# EAGLE design B130X (EAGLE 6.6.0)
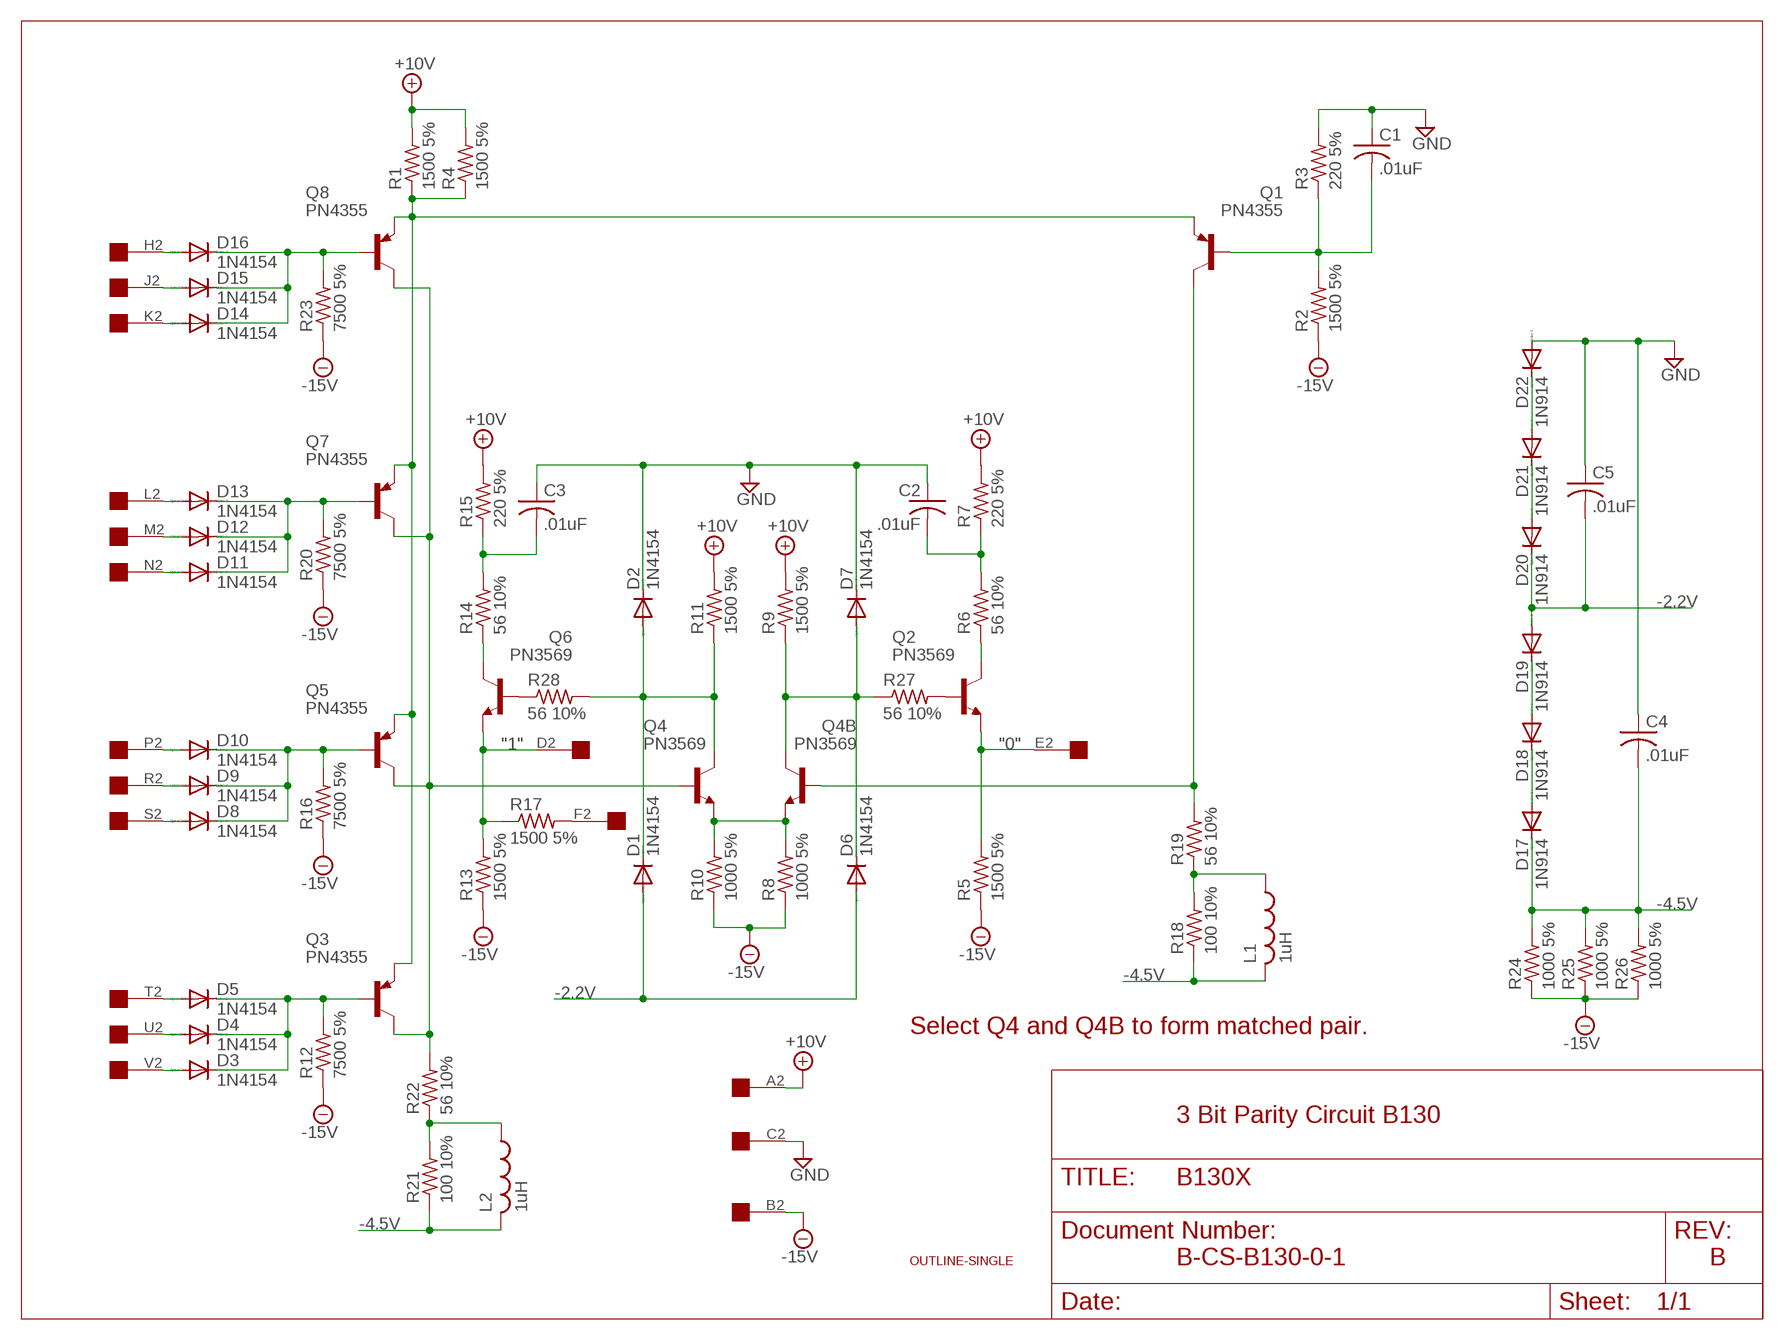
[diagram p0: schematic, sheet 1]

## Parts
C1  .01uF  C-US050-025X075  [C050-025X075]
C2  .01uF  C-US050-025X075  [C050-025X075]
C3  .01uF  C-US050-025X075  [C050-025X075]
C4  .01uF  C-US050-025X075  [C050-025X075]
C5  .01uF  C-US050-025X075  [C050-025X075]
D1  1N4154  1N4148DO35-10  [DO35-10]
D2  1N4154  1N4148DO35-10  [DO35-10]
D3  1N4154  1N4148DO35-10  [DO35-10]
D4  1N4154  1N4148DO35-10  [DO35-10]
D5  1N4154  1N4148DO35-10  [DO35-10]
D6  1N4154  1N4148DO35-10  [DO35-10]
D7  1N4154  1N4148DO35-10  [DO35-10]
D8  1N4154  1N4148DO35-10  [DO35-10]
D9  1N4154  1N4148DO35-10  [DO35-10]
D10  1N4154  1N4148DO35-10  [DO35-10]
D11  1N4154  1N4148DO35-10  [DO35-10]
D12  1N4154  1N4148DO35-10  [DO35-10]
D13  1N4154  1N4148DO35-10  [DO35-10]
D14  1N4154  1N4148DO35-10  [DO35-10]
D15  1N4154  1N4148DO35-10  [DO35-10]
D16  1N4154  1N4148DO35-10  [DO35-10]
D17  1N914  1N4148DO35-10  [DO35-10]
D18  1N914  1N4148DO35-10  [DO35-10]
D19  1N914  1N4148DO35-10  [DO35-10]
D20  1N914  1N4148DO35-10  [DO35-10]
D21  1N914  1N4148DO35-10  [DO35-10]
D22  1N914  1N4148DO35-10  [DO35-10]
L1  1uH  L-US0207/10  [0207/10]
L2  1uH  L-US0207/10  [0207/10]
Q1  PN4355  2N2904  [TO39]
Q2  PN3569  2N2102  [TO5]
Q3  PN4355  2N2904  [TO39]
Q4  PN3569  2N2102  [TO5]
Q4B  PN3569  2N2102  [TO5]
Q5  PN4355  2N2904  [TO39]
Q6  PN3569  2N2102  [TO5]
Q7  PN4355  2N2904  [TO39]
Q8  PN4355  2N2904  [TO39]
R1  1500 5%  R-US_0207/10  [0207/10]
R2  1500 5%  R-US_0207/10  [0207/10]
R3  220 5%  R-US_0207/10  [0207/10]
R4  1500 5%  R-US_0207/10  [0207/10]
R5  1500 5%  R-US_0207/10  [0207/10]
R6  56 10%  R-US_0207/10  [0207/10]
R7  220 5%  R-US_0207/10  [0207/10]
R8  1000 5%  R-US_0207/10  [0207/10]
R9  1500 5%  R-US_0207/10  [0207/10]
R10  1000 5%  R-US_0207/10  [0207/10]
R11  1500 5%  R-US_0207/10  [0207/10]
R12  7500 5%  R-US_0207/10  [0207/10]
R13  1500 5%  R-US_0207/10  [0207/10]
R14  56 10%  R-US_0207/10  [0207/10]
R15  220 5%  R-US_0207/10  [0207/10]
R16  7500 5%  R-US_0207/10  [0207/10]
R17  1500 5%  R-US_0207/10  [0207/10]
R18  100 10%  R-US_0207/10  [0207/10]
R19  56 10%  R-US_0207/10  [0207/10]
R20  7500 5%  R-US_0207/10  [0207/10]
R21  100 10%  R-US_0207/10  [0207/10]
R22  56 10%  R-US_0207/10  [0207/10]
R23  7500 5%  R-US_0207/10  [0207/10]
R24  1000 5%  R-US_0207/10  [0207/10]
R25  1000 5%  R-US_0207/10  [0207/10]
R26  1000 5%  R-US_0207/10  [0207/10]
R27  56 10%  R-US_0207/10  [0207/10]
R28  56 10%  R-US_0207/10  [0207/10]
U$1  OUTLINE-SINGLE  [SINGLE]
U$2  EDGE-1  [EDGE-CON1]

## Nets
"0": Q2.1(E) R5.2 U$2.E2
"1": Q6.1(E) R13.2 R17.1 U$2.D2
+10V: R1.2 R4.2 R7.2 R9.2 R11.2 R15.2 U$2.A2
-2.2V: C5.2 D1.A D6.A D19.A D20.C
-4.5V: C4.2 D17.C L1.2 L2.2 R18.1 R21.1 R24.2 R25.2 R26.2
-15V: R2.1 R5.1 R8.1 R10.1 R12.1 R13.1 R16.1 R20.1 R23.1 R24.1 R25.1 R26.1 U$2.B2
GND [Supply]: C1.1 C2.1 C3.1 C4.1 C5.1 D2.C D7.C D22.A R3.2 U$2.C2
N$1: D16.A U$2.H2
N$2: D18.A D19.C
N$3: D15.A U$2.J2
N$4: D17.A D18.C
N$5: Q1.1(E) Q3.1(E) Q5.1(E) Q7.1(E) Q8.1(E) R1.1 R4.1
N$6: D14.A U$2.K2
N$7: D14.C D15.C D16.C Q8.2(B) R23.2
N$8: D13.A U$2.L2
N$9: D12.A U$2.M2
N$10: L2.1 R21.2 R22.1
N$11: D11.A U$2.N2
N$12: D11.C D12.C D13.C Q7.2(B) R20.2
N$13: D10.A U$2.P2
N$14: D9.A U$2.R2
N$15: D8.A U$2.S2
N$16: D8.C D9.C D10.C Q5.2(B) R16.2
N$17: D5.A U$2.T2
N$18: D4.A U$2.U2
N$19: D3.A U$2.V2
N$20: D3.C D4.C D5.C Q3.2(B) R12.2
N$21: Q3.3(C) Q4.2(B) Q5.3(C) Q7.3(C) Q8.3(C) R22.2
N$22: Q4.1(E) Q4B.1(E) R8.2 R10.2
N$23: D1.C D2.A Q4.3(C) R11.1 R28.2
N$24: D6.C D7.A Q4B.3(C) R9.1 R27.1
N$25: Q6.2(B) R28.1
N$26: D21.A D22.C
N$27: D20.A D21.C
N$28: Q2.2(B) R27.2
N$29: Q1.3(C) Q4B.2(B) R19.2
N$30: C1.2 Q1.2(B) R2.2 R3.1
N$31: R17.2 U$2.F2
N$32: Q2.3(C) R6.1
N$33: Q6.3(C) R14.1
N$34: C3.2 R14.2 R15.1
N$35: C2.2 R6.2 R7.1
N$36: L1.1 R18.2 R19.1

## Notes on the sheet
- Select Q4 and Q4B to form matched pair.
- 3 Bit Parity Circuit B130
- B-CS-B130-0-1 | B

## Library data of the parts
C1-C5 = rcl:C-US: CAPACITOR, American symbol
D1-D22 = diode:1N4148: DIODE high speed (Philips)
L1 L2 = rcl:L-US: INDUCTOR, American symbol
Q1 Q3 Q5 Q7 Q8 = transistor-pnp:2N2904*: PNP Transistror
Q2 Q4 Q4B Q6 = transistor-npn:2N2102: NPN Transistor
R1-R28 = rcl:R-US_: RESISTOR, American symbol
U$1 = dec-con:OUTLINE-*: Board outlines for DEC boards.
U$2 = dec-con:EDGE-1: Single-Sided DEC Edge Connector -- (side 2)

## Net classes
1 Supply: width 0.813 mm

## Board
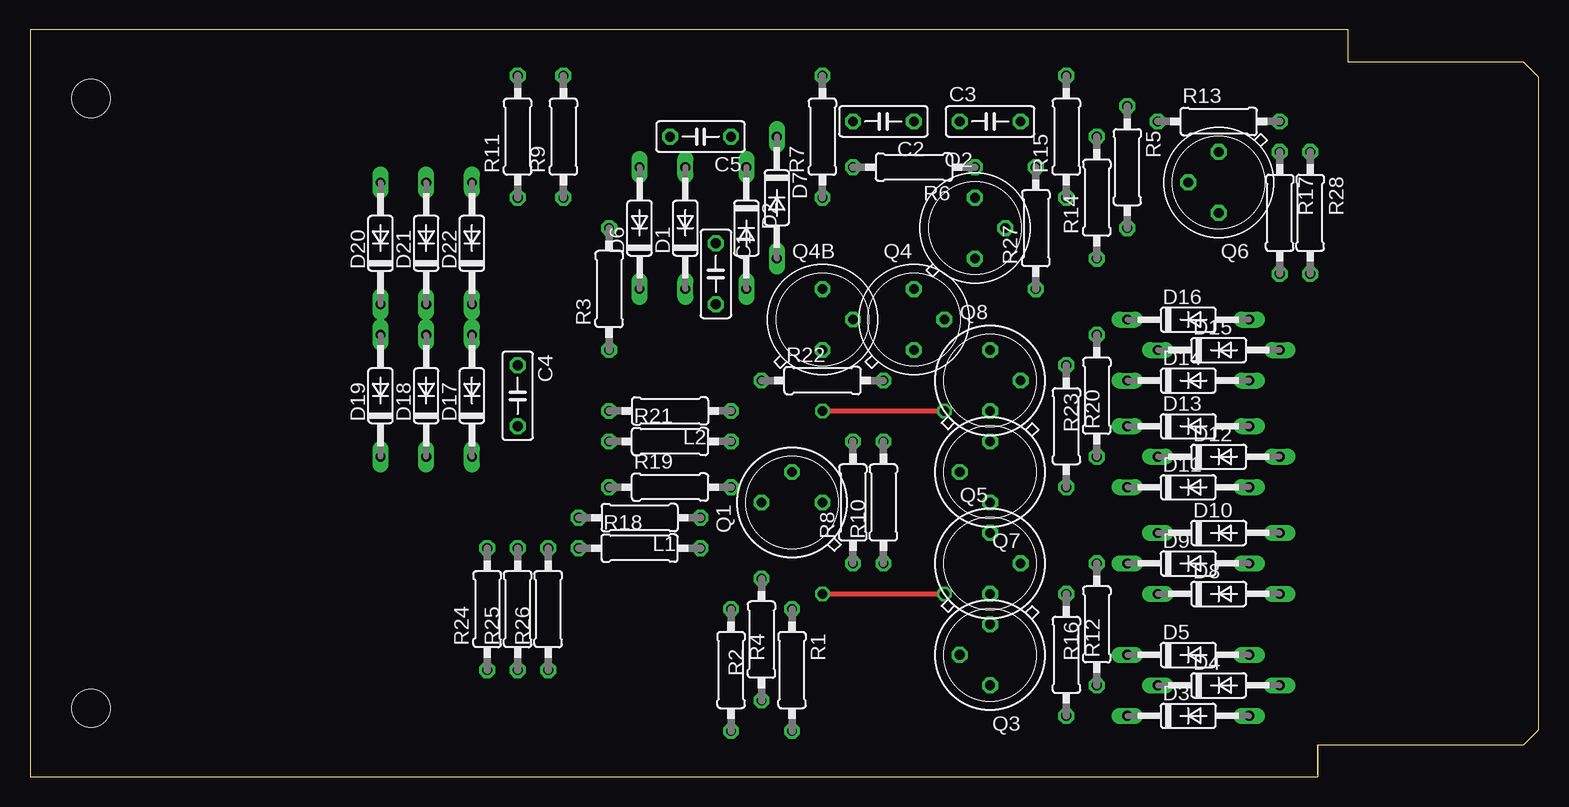
[diagram p1: board, top side]
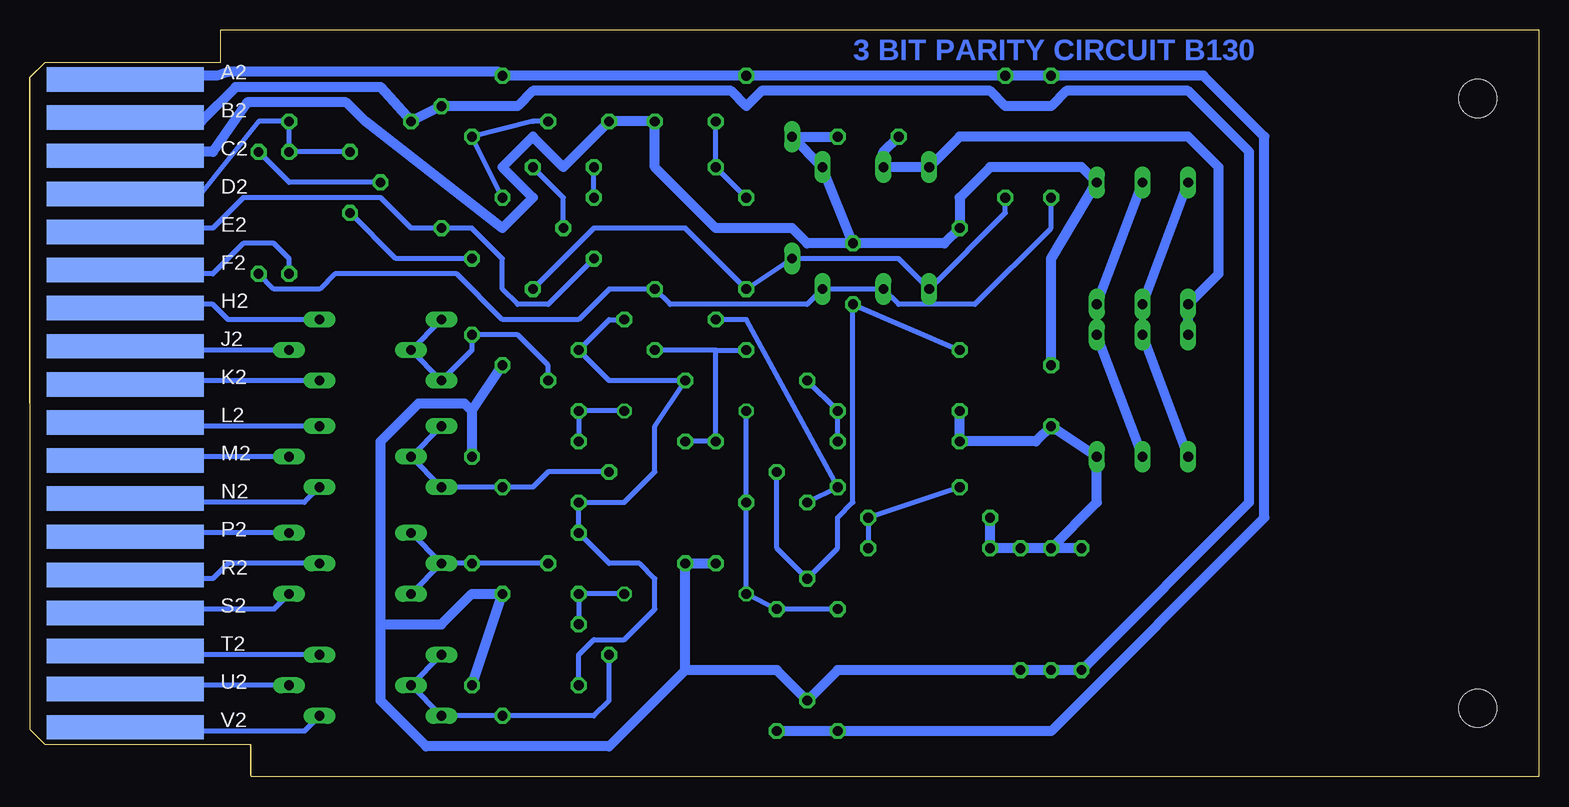
[diagram p2: board, bottom side, seen from below]

Size 125.73 x 62.23 mm. Coordinates in mm from the lower left corner, seen from the top.
Copper layers (1+16): Top 0.035mm / dielectric 1.5mm / Bottom 0.035mm
Design rules "16mils": minimum track width 16mil, minimum drill 32mil, track to track 15mil, track to pad 10mil, pad to pad 10mil, via to via 10mil, smd to smd 10mil, copper to edge 13mil, drill to drill 10mil, minimum pad ring 10mil, minimum via ring 8mil, stop-mask expansion 0mil, vias tented up to drill 0mil, thermal gap 10mil

### Footprints (pad centres in the part's own frame; a part is rotated, then mirrored left to right if it is on the bottom)
C050-025X075 = drill 0.813 octagon: 1 -2.54,0; 2 2.54,0
DO35-10 = drill 0.813 long: A 5.08,0; C -5.08,0
0207/10 = drill 0.813 octagon: 1 -5.08,0; 2 5.08,0
TO39 = drill 0.813 octagon: 1 0,-2.54; 2 2.54,0; 3 0,2.54
TO5 = drill 0.813 octagon: 1 0,-2.54; 2 2.54,0; 3 0,2.54
SINGLE = hole 3.175: 120.65,56.515; 120.65,5.715
EDGE-CON1 = smd 13.106 x 2.032 bottom: A2 7.938,4.128; B2 7.938,7.303; C2 7.938,10.477; D2 7.938,13.652; E2 7.938,16.828; F2 7.938,20.003; H2 7.938,23.177; J2 7.938,26.352; K2 7.938,29.527; L2 7.938,32.703; M2 7.938,35.877; N2 7.938,39.053; P2 7.938,42.227; R2 7.938,45.403; S2 7.938,48.578; T2 7.938,51.752; U2 7.938,54.928; V2 7.938,58.102

### Placement (x,y rotation side)
C1  57.15,41.91 270 top
C2  71.12,54.61 180 top
C3  80.01,54.61 0 top
C4  40.64,31.75 270 top
C5  55.88,53.34 180 top
D1  54.61,45.72 90 top
D2  59.69,45.72 270 top
D3  96.52,5.08 0 top
D4  99.06,7.62 0 top
D5  96.52,10.16 0 top
D6  50.8,45.72 90 top
D7  62.23,48.26 270 top
D8  99.06,15.24 0 top
D9  96.52,17.78 0 top
D10  99.06,20.32 0 top
D11  96.52,24.13 0 top
D12  99.06,26.67 0 top
D13  96.52,29.21 0 top
D14  96.52,33.02 0 top
D15  99.06,35.56 0 top
D16  96.52,38.1 0 top
D17  36.83,31.75 90 top
D18  33.02,31.75 90 top
D19  29.21,31.75 90 top
D20  29.21,44.45 90 top
D21  33.02,44.45 90 top
D22  36.83,44.45 90 top
L1  50.8,21.59 180 top
L2  53.34,30.48 180 top
Q1  63.5,22.86 90 top
Q2  78.74,45.72 0 top
Q3  80.01,10.16 180 top
Q4  73.66,38.1 0 top
Q4B  66.04,38.1 0 top
Q5  80.01,17.78 0 top
Q6  99.06,49.53 180 top
Q7  80.01,25.4 180 top
Q8  80.01,33.02 0 top
R1  63.5,8.89 270 top
R2  60.96,11.43 90 top
R3  48.26,40.64 90 top
R4  58.42,8.89 270 top
R5  91.44,50.8 270 top
R6  73.66,50.8 180 top
R7  66.04,53.34 90 top
R8  68.58,22.86 90 top
R9  44.45,53.34 90 top
R10  71.12,22.86 90 top
R11  40.64,53.34 90 top
R12  86.36,10.16 270 top
R13  99.06,54.61 0 top
R14  88.9,48.26 90 top
R15  86.36,53.34 90 top
R16  88.9,12.7 90 top
R17  104.14,46.99 270 top
R18  50.8,19.05 0 top
R19  53.34,24.13 0 top
R20  86.36,29.21 270 top
R21  53.34,27.94 0 top
R22  66.04,33.02 0 top
R23  88.9,31.75 90 top
R24  38.1,13.97 90 top
R25  40.64,13.97 90 top
R26  43.18,13.97 90 top
R27  83.82,45.72 90 top
R28  106.68,46.99 270 top
U$1  125.73,62.23 180 top
U$2  125.73,62.23 180 top

### Tracks (layer width: path | path; a pad name or v marks a point on that pad's centre or on a via)
"0"
  Bottom 0.406: U$2.E2 117.17,45.39 116.84,45.72 110.49,45.72 107.95,48.26 96.52,48.26 93.98,45.72 R5.2 88.9,45.72 86.36,43.18 86.36,40.64 85.09,39.37 82.55,39.37 Q2.1
"1"
  Bottom 0.406: U$2.D2 117.14,48.56 116.84,48.26 111.76,48.26 106.68,54.61 R13.2 R17.1 Q6.1
+10V
  Bottom 0.813: U$2.A2 117.22,58.04 116.84,58.42 110.17,58.42 109.22,58.74 86.68,58.74 R15.2 R7.2 R9.2 R11.2 27.94,58.42 22.86,53.34 22.86,21.59 40.64,3.81 R4.2 R1.2
-2.2V
  Bottom 0.813: D19.A D20.C 26.67,41.91 26.67,50.8 29.21,53.34 48.26,53.34 D6.A D1.A 54.61,52.07 C5.2
-4.5V
  Bottom 0.813: R25.2 36.83,22.86 D17.C C4.2 41.91,27.94 R21.1 L2.2 | R24.2 R25.2 | R25.2 R26.2 R18.1 L1.2
-15V
  Bottom 0.813: R16.1 R12.1 88.9,15.24 91.44,12.7 96.52,12.7 | 88.9,30.48 R23.1 | 96.52,12.7 96.52,27.94 93.34,31.11 89.53,31.11 88.9,30.48 | 88.9,30.48 R20.1 | 96.52,12.7 96.52,6.35 92.71,2.54 77.47,2.54 71.12,8.89 | U$2.B2 117.13,54.9 116.84,54.61 111.44,54.61 108.58,57.47 96.52,57.47 R13.1 R5.1 85.09,55.88 83.82,57.15 67.31,57.15 66.04,55.88 64.77,57.15 45.72,57.15 44.45,55.88 40.64,55.88 39.37,57.15 29.21,57.15 24.13,52.07 24.13,22.86 R24.1 R25.1 R26.1 58.42,8.89 R2.1 63.5,8.89 71.12,8.89 | 71.12,8.89 R10.1 R8.1
GND
  Bottom 0.813: U$2.C2 117.17,51.74 116.84,52.07 110.49,52.07 107.63,56.2 99.38,56.2 97.79,54.61 86.36,45.72 83.82,48.26 86.36,50.8 83.82,53.34 81.28,50.8 C3.1 C2.1 73.66,50.8 68.58,45.72 62.23,45.72 60.96,44.45 C1.1 | C4.1 40.64,43.18 D22.A 38.1,50.8 45.72,50.8 48.26,48.26 R3.2 49.53,44.45 C1.1 | C1.1 D2.C D7.C C5.1
N$1
  Bottom 0.406: U$2.H2 117.17,39.04 116.84,39.37 110.49,39.37 109.22,38.1 D16.A
N$2
  Bottom 0.813: D19.C D18.A
N$3
  Bottom 0.406: U$2.J2 117.17,35.89 116.84,35.56 D15.A
N$4
  Bottom 0.813: D18.C D17.A
N$5  (via drill 0.81)
  Top 0.406: v66.04,30.48 v76.2,30.48 | v66.04,15.24 v76.2,15.24
  Bottom 0.406: Q3.1 Q5.1 v76.2,15.24 | v76.2,30.48 Q8.1 Q7.1 | v66.04,30.48 Q1.1 v66.04,15.24 R1.1 R4.1
N$6
  Bottom 0.406: U$2.K2 117.14,32.72 116.84,33.02 D14.A
N$7
  Bottom 0.406: D16.C D15.C D14.C 88.9,35.56 R23.2 85.09,36.83 82.55,34.29 Q8.2
N$8
  Bottom 0.406: U$2.L2 117.17,29.54 116.84,29.21 D13.A
N$9
  Bottom 0.406: U$2.M2 117.17,26.34 116.84,26.67 D12.A
N$10
  Bottom 0.406: R22.1 L2.1 R21.2
N$11
  Bottom 0.406: U$2.N2 117.17,23.19 116.84,22.86 102.87,22.86 D11.A
N$12
  Bottom 0.406: D13.C D12.C D11.C R20.2 83.82,24.13 82.55,25.4 Q7.2
N$13
  Bottom 0.406: U$2.P2 117.17,19.99 116.84,20.32 D10.A
N$14
  Bottom 0.406: U$2.R2 117.17,16.84 116.84,16.51 110.49,16.51 109.22,17.78 D9.A
N$15
  Bottom 0.406: U$2.S2 117.14,13.66 116.84,13.97 105.41,13.97 D8.A
N$16
  Bottom 0.406: D9.C D8.C | D9.C D10.C | D9.C R16.2 Q5.2
N$17
  Bottom 0.406: U$2.T2 117.17,10.49 116.84,10.16 D5.A
N$18
  Bottom 0.406: U$2.U2 117.2,7.26 116.84,7.62 D4.A
N$19
  Bottom 0.406: U$2.V2 117.16,4.13 116.84,3.81 102.87,3.81 D3.A
N$20
  Bottom 0.406: D5.C D4.C D3.C R12.2 78.74,5.08 77.47,6.35 Q3.2
N$21
  Bottom 0.406: Q3.3 80.01,10.16 78.74,11.43 76.2,11.43 73.66,13.97 73.66,16.51 74.93,17.78 77.47,17.78 Q5.3 Q7.3 76.2,22.86 73.66,25.4 73.66,29.21 R22.2 77.47,33.02 Q8.3 77.47,38.1 Q4.2
N$22
  Bottom 0.406: R10.2 R8.2 68.58,35.56 | 68.58,35.56 Q4.1 | 68.58,35.56 Q4B.1
N$23
  Bottom 0.406: R28.2 105.41,40.64 101.6,40.64 100.33,41.91 90.17,41.91 86.36,38.1 80.01,38.1 77.47,40.64 Q4.3 72.39,39.37 60.96,39.37 D2.A D1.C 53.34,39.37 46.99,39.37 40.64,45.72 R11.1
N$24
  Bottom 0.406: R27.1 78.74,45.72 71.12,45.72 Q4B.3 D7.A 53.34,43.18 D6.C 44.45,46.99 R9.1
N$25
  Bottom 0.406: Q6.2 104.14,49.53 R28.1
N$26
  Bottom 0.813: D22.C D21.A
N$27
  Bottom 0.813: D21.C D20.A
N$28
  Bottom 0.406: Q2.2 81.28,48.26 R27.2
N$29
  Bottom 0.406: Q4B.2 66.04,38.1 R19.2 Q1.3
N$30
  Bottom 0.406: Q1.2 63.5,19.05 R2.2 58.42,19.05 58.42,21.59 57.15,22.86 C1.2 R3.1
N$31
  Bottom 0.406: U$2.F2 117.12,42.19 116.84,41.91 110.49,41.91 107.95,44.45 105.41,44.45 104.14,43.18 R17.2
N$32
  Bottom 0.406: Q2.3 R6.1
N$33
  Bottom 0.406: R14.1 95.25,43.18 Q6.3
N$34
  Bottom 0.406: R15.1 R14.2 83.82,54.61 C3.2
N$35
  Bottom 0.406: R7.1 R6.2 C2.2
N$36
  Bottom 0.406: R19.1 L1.1 R18.2

### Text on the board
Bottom: 3 BIT PARITY CIRCUIT B130